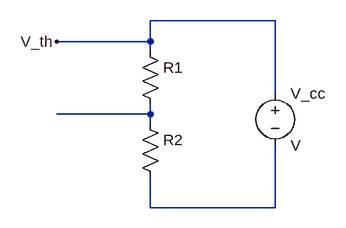
[diagram p0: schematic transistor_thev_analysis.asc]
transistor_thev_analysis.asc, the LTspice schematic file:
Version 4
SHEET 1 880 680
WIRE 432 32 240 32
WIRE 240 64 240 32
WIRE 240 64 96 64
WIRE 240 80 240 64
WIRE 432 144 432 32
WIRE 240 176 240 160
WIRE 240 176 96 176
WIRE 240 192 240 176
WIRE 240 320 240 272
WIRE 432 320 432 224
WIRE 432 320 240 320
FLAG 96 64 V_th
SYMBOL voltage 432 128 R0
SYMATTR InstName V_cc
SYMBOL res 224 64 R0
SYMATTR InstName R1
SYMATTR Value ""
SYMBOL res 224 176 R0
SYMATTR InstName R2
SYMATTR Value ""

The netlist it stands for:
* transistor_thev_analysis.asc
V_cc V_th N002 V
R1 V_th N001
R2 N001 N002
.backanno
.end